# Altium schematic sheet MCU.SchDoc: Carte Découpe DMX
size A4
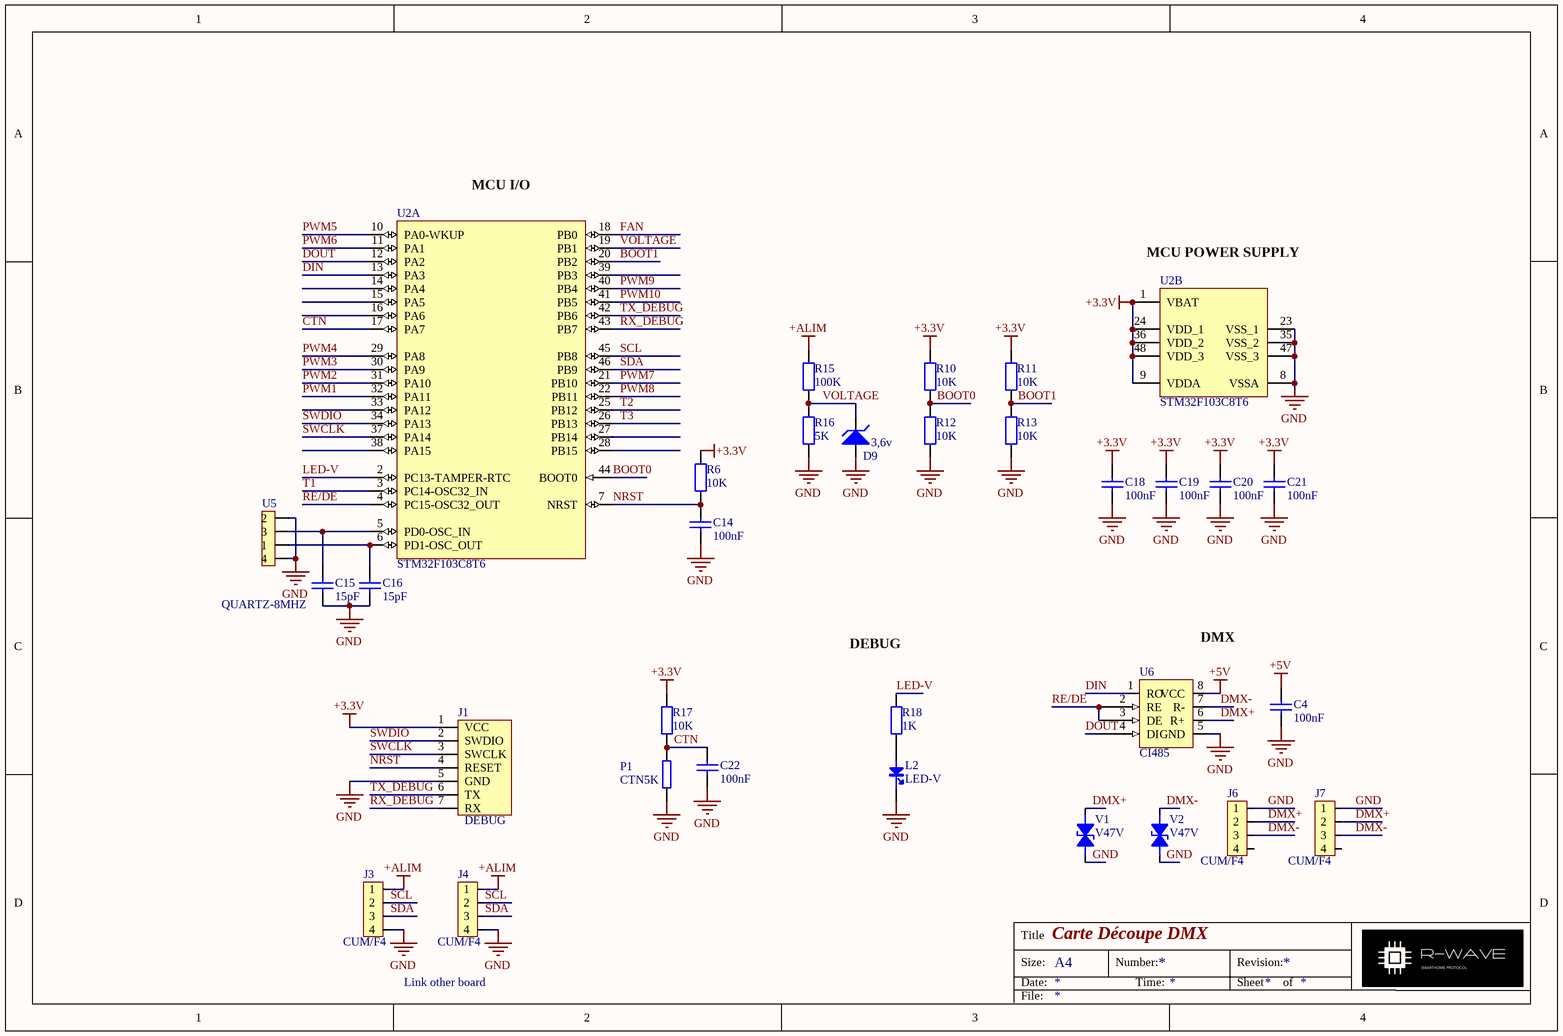
[diagram p0: MCU.SchDoc]

## Parts
C4  100nF  [C0603]
C14  100nF  [C0603]
C15  15pF  [C0603]
C16  15pF  [C0603]
C18  100nF  [C0603]
C19  100nF  [C0603]
C20  100nF  [C0603]
C21  100nF  [C0603]
C22  100nF  [C0603]
D9  3,6v  [SOD123]
J1  (no value)  [CON_PROG]
J3  CUM/F4  [CNT4F5]
J4  CUM/F4  [CNT4F5]
J6  CUM/F4  [CNT4S]
J7  CUM/F4  [CNT4S]
L2  LED-V  [LED-V1A]
P1  CTN5K  [DIV015]
R6  10K  [R0603]
R10  10K  [R0603]
R11  10K  [R0603]
R12  10K  [R0603]
R13  10K  [R0603]
R15  100K  [R0603]
R16  5K  [R0603]
R17  10K  [R0603]
R18  1K  [R0603]
U2  STM32F103C8T6  [TQFP-48]  (parts A,B of 2)
U5  QUARTZ-8MHZ  [QUA8G]
U6  CI485  [CIA485A]
V1  V47V  [VAR47A]
V2  V47V  [VAR47A]

## Nets
+3.3V: C18.2 C19.2 C20.2 C21.2 J1.1(VCC) R6.2 R10.2 R11.2 R17.2 U2.1(VBAT) U2.9(VDDA) U2.24(VDD_1) U2.36(VDD_2) U2.48(VDD_3)
+5V: C4.2 U6.8(VCC)
+ALIM: J3.1 J4.1 R15.2
GND: C4.1 C14.1 C15.2 C16.1 C18.1 C19.1 C20.1 C21.1 C22.1 D9.1(A) J1.5(GND) J3.4 J4.4 J6.1 J7.1 L2.2 P1.1 R12.1 R13.1 R16.1 U2.8(VSSA) U2.23(VSS_1) U2.35(VSS_2) U2.47(VSS_3) U5.2 U5.4 U6.5(GND) V1.2 V2.2
BOOT0: R10.1 R12.2 U2.44(BOOT0)
BOOT1: R11.1 R13.2 U2.20(PB2)
CTN: C22.2 P1.2 R17.1 U2.17(PA7)
DIN: U2.13(PA3) U6.1(RO)
DMX+: J6.2 J7.2 U6.6(R+) V1.1
DMX-: J6.3 J7.3 U6.7(R-) V2.1
DOUT: U2.12(PA2) U6.4(DI)
FAN: U2.18(PB0)
LED-V: R18.2 U2.2(PC13-TAMPER-RTC)
NRST: C14.2 J1.4(RESET) R6.1 U2.7(NRST)
PWM1: U2.32(PA11)
PWM2: U2.31(PA10)
PWM3: U2.30(PA9)
PWM4: U2.29(PA8)
PWM5: U2.10(PA0-WKUP)
PWM6: U2.11(PA1)
PWM7: U2.21(PB10)
PWM8: U2.22(PB11)
PWM9: U2.40(PB4)
PWM10: U2.41(PB5)
RE/DE: U2.4(PC15-OSC32_OUT) U6.2(RE) U6.3(DE)
RX_DEBUG: J1.7(RX) U2.43(PB7)
SCL: J3.2 J4.2 U2.45(PB8)
SDA: J3.3 J4.3 U2.46(PB9)
SWCLK: J1.3(SWCLK) U2.37(PA14)
SWDIO: J1.2(SWDIO) U2.34(PA13)
T1: U2.3(PC14-OSC32_IN)
T2: U2.25(PB12)
T3: U2.26(PB13)
TX_DEBUG: J1.6(TX) U2.42(PB6)
VOLTAGE: D9.2(K) R15.1 R16.2 U2.19(PB1)
NetC15_1: C15.1 U2.5(PD0-OSC_IN) U5.3
NetC16_2: C16.2 U2.6(PD1-OSC_OUT) U5.1
NetL2_1: L2.1 R18.1

Not connected (* = marked no-connect by the designer): J6 4; J7 4; U2 14(PA4) 15(PA5) 16(PA6) 27(PB14) 28(PB15) 33(PA12) 38(PA15) 39(PB3)

## Notes on the sheet
- (near U2) MCU I/O
- (near U2) MCU POWER SUPPLY
- DEBUG
- (near U6) DMX
- (near J1) DEBUG
- Link other board
- Title
- Size:
- Date:
- A4
- Number:
- Time:
- Revision:
- Sheet
- of
- File:

## Library data of the parts
C4 C14-C16 C18-C22 = Cap: Capacitor
  C4 C14 C18-C22: Value: 100nF
  C15 C16: Value: 15pF
D9 = D Zener: Zener Diode; Value: 3,6v
J1 = CON-PROG: Programming Connector
J3 J4 J6 J7 = CUM/F4: connecteur  4 points
L2 = LED-V: LED  piquer  ou  CMS verte
P1 = CTN5K: Photoresistance
R6 R10-R13 R15-R18 = Res: Thin Metal Film Resistor
  R6 R10-R13 R17: Value: 10K
  R15: Value: 100K
  R16: Value: 5K
  R18: Value: 1K
U2 = STM32F103C8T6: ARM Cortex-M3 32-bit MCU, 64 KB Flash, 20 KB Internal RAM, 37 I/Os, 48-pin LQFP, -40 to 85 degC, Tray; Operating Frequency(F) (Processor speed) (MHz): 72; Supply Voltage(Vcc) min (V): 2; FLASH Size (Prog) (kB): 64; Internal RAM Size (kB): 20; I/Os (High Current): 37; A/D Converter: 2x12-bit (10 Channel); Core: ARM Cortex-M3; ComponentLink2Description: Datasheet; ComponentLink3Description: Package Specification; Mounting Technology: Surface Mount; ComponentLink3URL: http://www.st.com/st-web-ui/static/active/en/resource/technical/document/datasheet/DM00058181.pdf; DatasheetVersion: Rev. 16; ComponentLink1URL: http://www.st.com/web/en/home.html; ComponentLink1Description: Manufacturer URL; PartNumber: STM32F103C8T6; Packing: Tray; PackageVersion: Rev. 6, 06/2013; PackageReference: LQFP48; PackageDescription: 48-Pin Low Profile Quad Flat Package, 7 x 7 mm Body, 0.5 mm Pitch; ComponentLink2URL: http://www.st.com/st-web-ui/static/active/en/resource/technical/document/datasheet/CD00161566.pdf
U5 = QUARTZ-8MHZ: QUARTZ 8 MHZ CMS
U6 = CI485: DRIVER  RS485
V1 V2 = V47V: VARISTANCE 47V BOITIER 1206